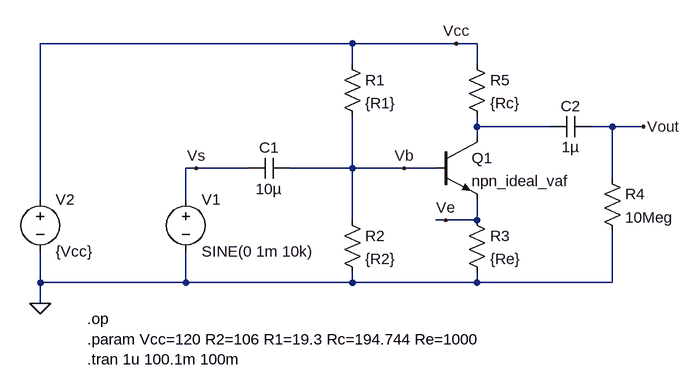
[diagram p0: schematic CE-degen-ro-nogain.asc]
CE-degen-ro-nogain.asc, the LTspice schematic file:
Version 4
SHEET 1 1236 680
WIRE 720 80 240 80
WIRE 880 80 720 80
WIRE 912 80 880 80
WIRE 720 112 720 80
WIRE 912 112 912 80
WIRE 912 208 912 192
WIRE 1024 208 912 208
WIRE 1120 208 1088 208
WIRE 1168 208 1120 208
WIRE 912 224 912 208
WIRE 480 272 464 272
WIRE 560 272 480 272
WIRE 720 272 720 192
WIRE 720 272 624 272
WIRE 800 272 720 272
WIRE 848 272 800 272
WIRE 1120 288 1120 208
WIRE 240 320 240 80
WIRE 464 320 464 272
WIRE 720 352 720 272
WIRE 864 352 848 352
WIRE 912 352 912 320
WIRE 912 352 864 352
WIRE 240 448 240 400
WIRE 464 448 464 400
WIRE 464 448 240 448
WIRE 720 448 720 432
WIRE 720 448 464 448
WIRE 912 448 912 432
WIRE 912 448 720 448
WIRE 1120 448 1120 368
WIRE 1120 448 912 448
WIRE 240 480 240 448
FLAG 240 480 0
FLAG 1168 208 Vout
FLAG 880 80 Vcc
FLAG 800 272 Vb
FLAG 864 352 Ve
FLAG 480 272 Vs
SYMBOL res 896 336 R0
SYMATTR InstName R3
SYMATTR Value {Re}
SYMBOL res 896 96 R0
SYMATTR InstName R5
SYMATTR Value {Rc}
SYMBOL voltage 464 304 R0
SYMATTR InstName V1
SYMATTR Value SINE(0 1m 10k)
SYMBOL voltage 240 304 R0
SYMATTR InstName V2
SYMATTR Value {Vcc}
SYMBOL Res 704 96 R0
SYMATTR InstName R1
SYMATTR Value {R1}
SYMBOL Res 704 336 R0
SYMATTR InstName R2
SYMATTR Value {R2}
SYMBOL Cap 560 288 R270
WINDOW 0 32 32 VTop 2
WINDOW 3 0 32 VBottom 2
SYMATTR InstName C1
SYMATTR Value 10µ
SYMBOL Cap 1024 224 R270
WINDOW 0 32 32 VTop 2
WINDOW 3 0 32 VBottom 2
SYMATTR InstName C2
SYMATTR Value 1µ
SYMBOL Res 1104 272 R0
SYMATTR InstName R4
SYMATTR Value 10Meg
SYMBOL npn 848 224 R0
SYMATTR InstName Q1
SYMATTR Value npn_ideal_vaf
TEXT 312 504 Left 2 !.op\n.param Vcc=120 R2=106 R1=19.3 Rc=194.744 Re=1000\n.tran 1u 100.1m 100m

The netlist it stands for:
* CE-degen-ro-nogain.asc
R3 Ve 0 {Re}
R5 Vcc N001 {Rc}
V1 Vs 0 SINE(0 1m 10k)
V2 Vcc 0 {Vcc}
R1 Vcc Vb {R1}
R2 Vb 0 {R2}
C1 Vs Vb 10µ
C2 N001 Vout 1µ
R4 Vout 0 10Meg
Q1 N001 Vb Ve 0 npn_ideal_vaf
.model NPN NPN
.model PNP PNP
.lib standard.bjt
.op
.param Vcc=120 R2=106 R1=19.3 Rc=194.744 Re=1000
.tran 1u 100.1m 100m
.backanno
.end